# EAGLE schematic mte1 (EAGLE 8.2.0)
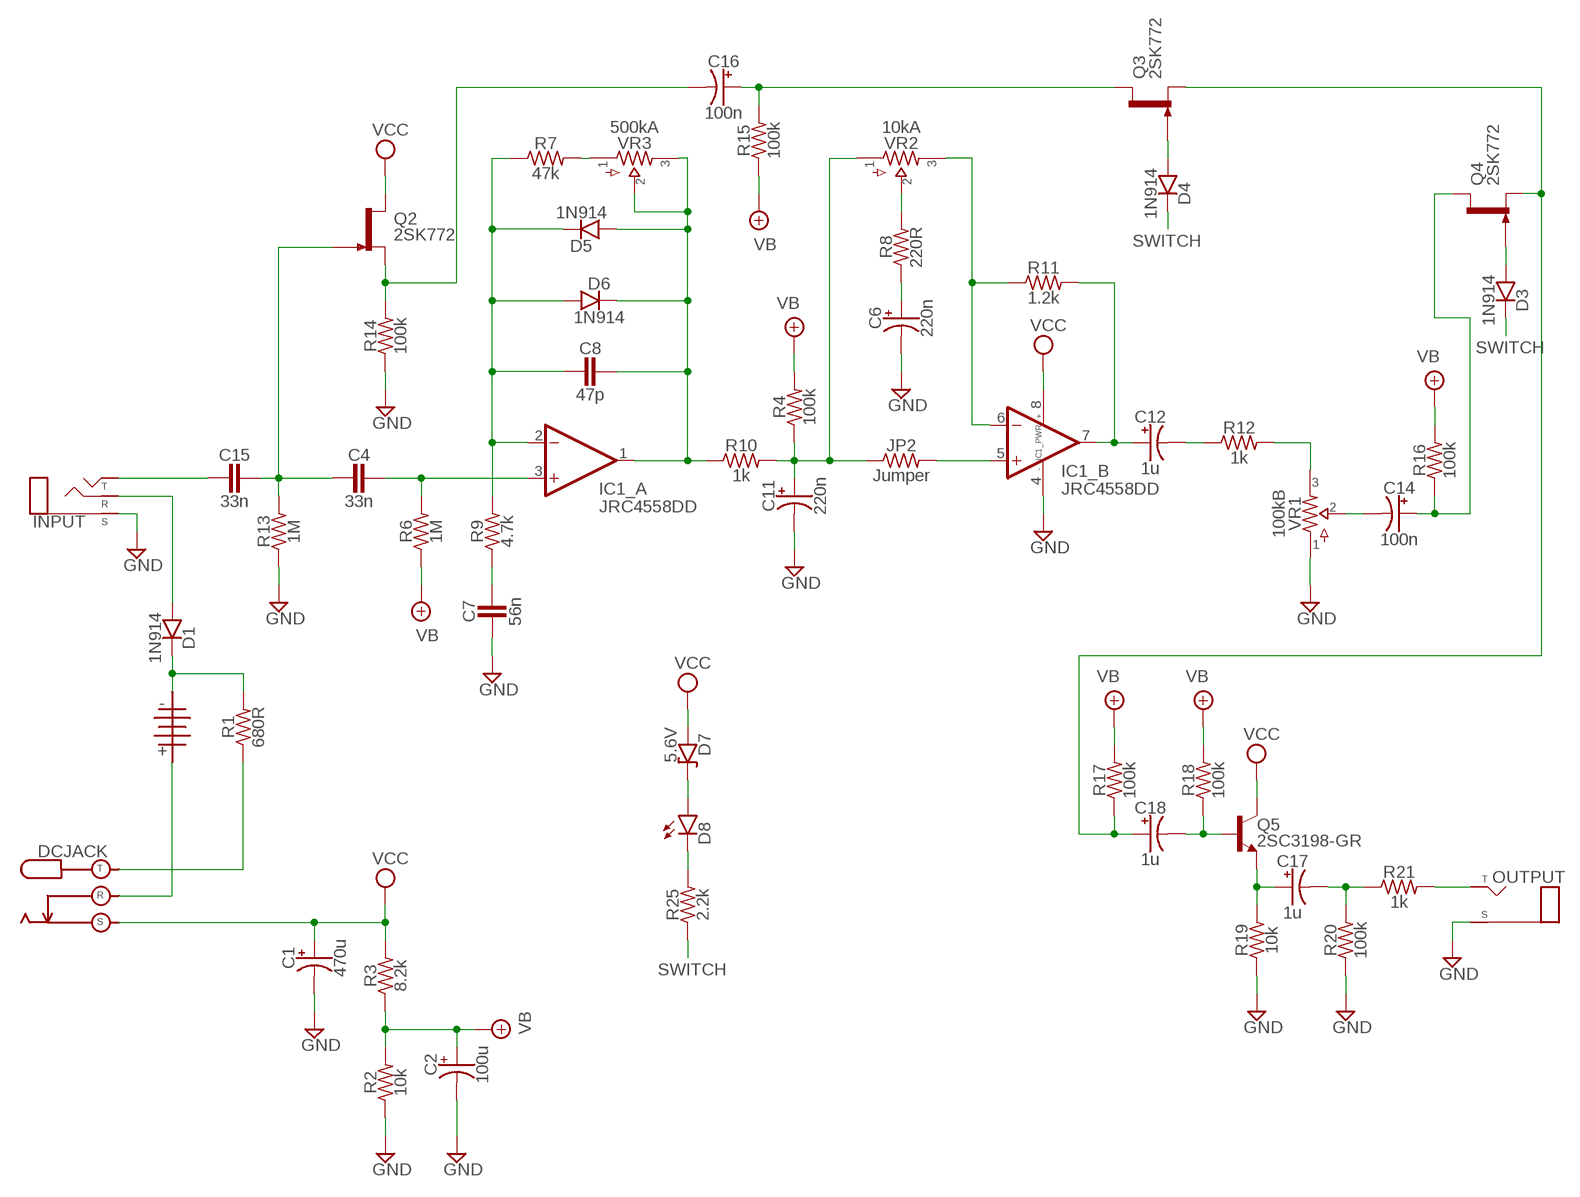
[diagram p0: schematic, sheet 1]

## Parts
1101  BATTERY  [TWO_PADS]
C1  470u  0400  [040_020]
C2  100u  0400  [040_020]
C4  33n  CER/FILMBOX.1  [BOX_SMALL]
C6  220n  0400  [040_020]
C7  56n  CER/FILMBOX.1  [BOX_SMALL]
C8  47p  CER/FILMBOX.1  [BOX_SMALL]
C11  220n  0400  [040_020]
C12  1u  0400  [040_020]
C14  100n  0400  [040_020]
C15  33n  CER/FILMBOX.1  [BOX_SMALL]
C16  100n  0400  [040_020]
C17  1u  0400  [040_020]
C18  1u  0400  [040_020]
D1  1N914  DO35.2  [DO35-2]
D3  1N914  DO35.2  [DO35-2]
D4  1N914  DO35.2  [DO35-2]
D5  1N914  DO35.2  [DO35-2]
D6  1N914  DO35.2  [DO35-2]
D7  5.6V  ZENER.2  [DO41-2]
D8  LED  [3MM_D]
DCJACK  DCJACK  DC_KOBICONN  [DC_KOBICONN]
IC1  JRC4558DD  DUALTH  [DIL0]
INPUT  INPUT  STEREO  [STEREO_PCB]
JP2  Jumper  R_.3B  [R0207/3]
OUTPUT  MONO  [TWO_PADS]
Q2  2SK772  2N5457  [TO92-]
Q3  2SK772  2N5457  [TO92-]
Q4  2SK772  2N5457  [TO92-]
Q5  2SC3198-GR  2N3904  [TO92-]
R1  680R  R_.3B  [R0207/3]
R2  10k  R_.3B  [R0207/3]
R3  8.2k  R_.3B  [R0207/3]
R4  100k  R_.3B  [R0207/3]
R6  1M  R_.3B  [R0207/3]
R7  47k  R_.3B  [R0207/3]
R8  220R  R_.3B  [R0207/3]
R9  4.7k  R_.3B  [R0207/3]
R10  1k  R_.3B  [R0207/3]
R11  1.2k  R_.3B  [R0207/3]
R12  1k  R_.3B  [R0207/3]
R13  1M  R_.3B  [R0207/3]
R14  100k  R_.3B  [R0207/3]
R15  100k  R_.3B  [R0207/3]
R16  100k  R_.3B  [R0207/3]
R17  100k  R_.3B  [R0207/3]
R18  100k  R_.3B  [R0207/3]
R19  10k  R_.3B  [R0207/3]
R20  100k  R_.3B  [R0207/3]
R21  1k  R_.3B  [R0207/3]
R25  2.2k  R_.3B  [R0207/3]
VR1  100kB  POTS16MM  [16MM]
VR2  10kA  POTS16MM  [16MM]
VR3  500kA  POTS16MM  [16MM]

## Nets
DCJACK: DCJACK.T R1.1
GND: C1.- C2.- C6.- C7.2 C11.- IC1.4(_PWR:V-) INPUT.P$1(S) OUTPUT.S(SLEEVE) R2.1 R13.1 R14.1 R19.1 R20.1 VR1.1
N$1: D1.A INPUT.P$2(R)
N$2: C14.- VR1.2
N$3: 1101.T DCJACK.R
N$4: 1101.S D1.C R1.2
N$5: C7.1 R9.1
N$6: C11.+ JP2.1 R4.1 R10.2 VR2.1
N$7: C8.2 D5.C D6.A IC1.2(_A:-IN) R7.1 R9.2
N$8: R7.2 VR3.1
N$9: C8.1 D5.A D6.C IC1.1(_A:OUT) R10.1 VR3.2 VR3.3
N$10: IC1.5(_B:+IN) JP2.2
N$11: C15.2 INPUT.P$3(T)
N$12: C4.2 C15.1 Q2.1(G) R13.2
N$13: C4.1 IC1.3(_A:+IN) R6.2
N$14: IC1.6(_B:-IN) R11.1 VR2.3
N$15: C12.+ IC1.7(_B:OUT) R11.2
N$16: R8.2 VR2.2
N$17: C6.+ R8.1
N$18: C12.- R12.1
N$19: R12.2 VR1.3
N$20: D7.C D8.ANODE(A)
N$21: C14.+ Q4.3(D) R16.1
N$22: C16.- Q2.2(S) R14.2
N$23: C16.+ Q3.3(D) R15.2
N$24: D4.A Q3.1(G)
N$25: C18.+ Q3.2(S) Q4.2(S) R17.1
N$26: D3.A Q4.1(G)
N$27: C18.- Q5.2(B) R18.1
N$28: C17.+ Q5.3(E) R19.2
N$29: C17.- R20.2 R21.1
N$30: OUTPUT.T(TIP) R21.2
N$31: D8.P$1(C) R25.2
SWITCH: D4.C
VB: C2.+ R2.2 R3.1 R4.2 R6.1 R15.1 R16.2 R17.2 R18.2
VCC: C1.+ D7.A DCJACK.S IC1.8(_PWR:V+) Q2.3(D) Q5.1(C) R3.2
Unconnected: D3.C R25.1

## Library data of the parts
1101 = pedals-jacks:BATTERY
C1 C2 C6 C11 C12 C14 C16-C18 = pedals-capacitors-elec:040
C4 C7 C8 C15 = pedals-capacitors-film:CER/FILM: 47 - 120pF Xicon Ceramic Disc 2.5mm lead spacing
D1 D3-D6 = pedals-diodes:DO35: DO-35 Package Diodes: 1N914
D7 = pedals-diodes:ZENER
D8 = pedals-diodes:LED
DCJACK = pedals-jacks:DC_KOBICONN
IC1 = pedals-integrated circuits:DUAL: OP AMP
INPUT = pedals-jacks:STEREO
JP2 R1-R4 R6-R21 R25 = pedals-resistors:R_
OUTPUT = pedals-jacks:MONO: Mono 1/4" Phone Jack
Q2-Q4 = pedals-transistors:2N5457: N-CHANNEL JFET
Q5 = pedals-transistors:2N3904: NPN Transistor
VR1-VR3 = pedals-potentiometers:POTS